# Altium project Compact Inverter DC Link V5.PrjPcb
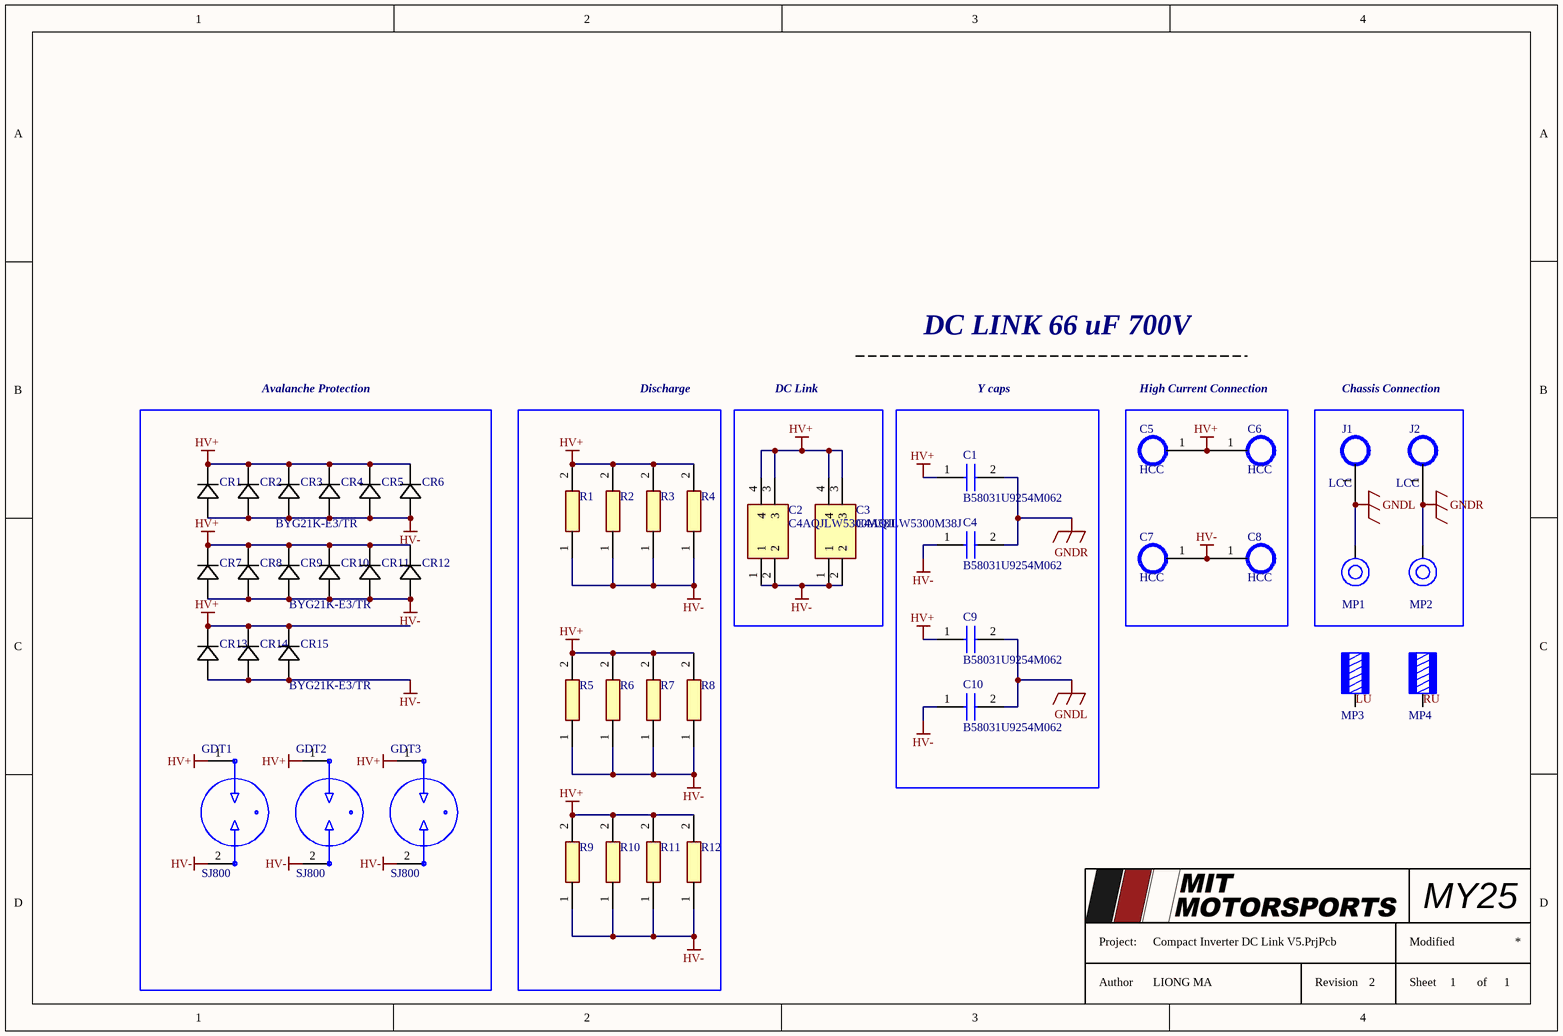
[diagram p0: Schematic.SchDoc]
Model: 24
1 sheet, 46 parts. Net scope: global (net labels, ports and power ports of the same name join across sheets).
Board file: PCB.PcbDoc

## Sheet Schematic.SchDoc
size A4; Author: LIONG MA; Revision: 2; SheetNumber: 1; SheetTotal: 1

### Parts
C1  B58031U9254M062  [B58031U9254M062]
C2  C4AQJLW5300M38J  [C4AQJLW5300M38J]
C3  C4AQJLW5300M38J  [C4AQJLW5300M38J]
C4  B58031U9254M062  [B58031U9254M062]
C5  HCC  [6mm Pad]
C6  HCC  [6mm Pad]
C7  HCC  [6mm Pad]
C8  HCC  [6mm Pad]
C9  B58031U9254M062  [B58031U9254M062]
C10  B58031U9254M062  [B58031U9254M062]
CR1  BYG21K-E3/TR  [DO-214AC_VIS]
CR2  BYG21K-E3/TR  [DO-214AC_VIS]  (value not drawn)
CR3  BYG21K-E3/TR  [DO-214AC_VIS]  (value not drawn)
CR4  BYG21K-E3/TR  [DO-214AC_VIS]  (value not drawn)
CR5  BYG21K-E3/TR  [DO-214AC_VIS]  (value not drawn)
CR6  BYG21K-E3/TR  [DO-214AC_VIS]  (value not drawn)
CR7  BYG21K-E3/TR  [DO-214AC_VIS]
CR8  BYG21K-E3/TR  [DO-214AC_VIS]  (value not drawn)
CR9  BYG21K-E3/TR  [DO-214AC_VIS]  (value not drawn)
CR10  BYG21K-E3/TR  [DO-214AC_VIS]  (value not drawn)
CR11  BYG21K-E3/TR  [DO-214AC_VIS]  (value not drawn)
CR12  BYG21K-E3/TR  [DO-214AC_VIS]  (value not drawn)
CR13  BYG21K-E3/TR  [DO-214AC_VIS]
CR14  BYG21K-E3/TR  [DO-214AC_VIS]  (value not drawn)
CR15  BYG21K-E3/TR  [DO-214AC_VIS]  (value not drawn)
GDT1  SJ800  [SJ1000]
GDT2  SJ800  [SJ1000]
GDT3  SJ800  [SJ1000]
J1  LCC  [PAD 3MM]
J2  LCC  [PAD 3MM]
MP1  M3 x 2.6mm  [9775026360]  (value not drawn)
MP2  M3 x 2.6mm  [9775026360]  (value not drawn)
MP3  M3  [7466313]  (value not drawn)
MP4  M3  [7466313]  (value not drawn)
R1  CHV2512-JW-105ELF  [RESC6432X75N]  (value not drawn)
R2  CHV2512-JW-105ELF  [RESC6432X75N]  (value not drawn)
R3  CHV2512-JW-105ELF  [RESC6432X75N]  (value not drawn)
R4  CHV2512-JW-105ELF  [RESC6432X75N]  (value not drawn)
R5  CHV2512-JW-105ELF  [RESC6432X75N]  (value not drawn)
R6  CHV2512-JW-105ELF  [RESC6432X75N]  (value not drawn)
R7  CHV2512-JW-105ELF  [RESC6432X75N]  (value not drawn)
R8  CHV2512-JW-105ELF  [RESC6432X75N]  (value not drawn)
R9  CHV2512-JW-105ELF  [RESC6432X75N]  (value not drawn)
R10  CHV2512-JW-105ELF  [RESC6432X75N]  (value not drawn)
R11  CHV2512-JW-105ELF  [RESC6432X75N]  (value not drawn)
R12  CHV2512-JW-105ELF  [RESC6432X75N]  (value not drawn)

### Blocks framed on the sheet
Avalanche Protection: CR1-CR15 GDT1-GDT3
Discharge: R1-R12
DC Link: C2 C3
Y caps: C1 C4 C9 C10
High Current Connection: C5-C8
Chassis Connection: J1 J2 MP1 MP2

### Nets
GNDL: C9.2 C10.2 J1.1 MP1.1
GNDR: C1.2 C4.2 J2.1 MP2.1
HV+: C1.1 C2.3 C2.4 C3.3 C3.4 C5.1 C6.1 C9.1 CR1.1 CR2.1 CR3.1 CR4.1 CR5.1 CR6.1 CR7.1 CR8.1 CR9.1 CR10.1 CR11.1 CR12.1 CR13.1 CR14.1 CR15.1 GDT1.1 GDT2.1 GDT3.1 R1.2 R2.2 R3.2 R4.2 R5.2 R6.2 R7.2 R8.2 R9.2 R10.2 R11.2 R12.2
HV-: C2.1 C2.2 C3.1 C3.2 C4.1 C7.1 C8.1 C10.1 CR1.2 CR2.2 CR3.2 CR4.2 CR5.2 CR6.2 CR7.2 CR8.2 CR9.2 CR10.2 CR11.2 CR12.2 CR13.2 CR14.2 CR15.2 GDT1.2 GDT2.2 GDT3.2 R1.1 R2.1 R3.1 R4.1 R5.1 R6.1 R7.1 R8.1 R9.1 R10.1 R11.1 R12.1
LU: MP3.1
RU: MP4.1

### Notes on the sheet
- DC LINK 66 uF 700V
- MY
- 25
- Project:
- Author
- Revision
- Sheet
- Modified
- of

### Library data of the parts
C1 C4 C9 C10 = B58031U9254M062: Capacitor; Manufacturer_Name: TDK; Datasheet Link: https://product.tdk.com/system/files/dam/doc/product/capacitor/ceramic/ceralink/data_sheet/20/10/ds/b58031_lp.pdf; Height: 4.5mm; Manufacturer_Part_Number: B58031U9254M062; Mouser Part Number: 871-B58031U9254M062; Mouser Price/Stock: https://www.mouser.co.uk/ProductDetail/EPCOS-TDK/B58031U9254M062?qs=Mv7BduZupUir5egwM6Ifng%3D%3D; Arrow Part Number: B58031U9254M062; Arrow Price/Stock: https://www.arrow.com/en/products/b58031u9254m062/tdk?region=europe
C2 C3 = C4AQJLW5300M38J: Capacitor; Manufacturer_Name: KEMET; Datasheet Link: https://content.kemet.com/datasheets/KEM_F3125_C4AQ_M.pdf; Height: 25.2mm; Manufacturer_Part_Number: C4AQJLW5300M38J; Mouser Part Number: 80-C4AQJLW5300M38J; Mouser Price/Stock: https://www.mouser.co.uk/ProductDetail/KEMET/C4AQJLW5300M38J?qs=81r%252BiQLm7BQPDIKgnvCGAA%3D%3D
CR1-CR15 = BYG21K-E3TR: 1.5A,800V,120nS FS AVALANCHE SMD; Manufacturer_Name: Vishay; Copyright: Copyright (C) 2025 Ultra Librarian. All rights reserved.; Manufacturer_Part_Number: BYG21K-E3/TR; Datasheet: https://www.vishay.com/doc?88961
GDT1-GDT3 = SJ800: Gas Discharge Tube; Manufacturer_Name: LITTELFUSE; Datasheet Link: https://www.littelfuse.com/assetdocs/gas-discharge-tubes-sj-datasheet?assetguid=53b7eae5-00a8-4e77-9ff5-6f0a5c35dc61; Height: 3.5mm; Manufacturer_Part_Number: SJ800
MP1 MP2 = 9775026360R: WA-SMSR SMT Steel Spacer Reverse, M3 x 2.6mm; Manufacturer: Wurth Elektronik; Inside Diameter: 4.2mm; Outside Diameter: 6mm; Surface: Tin; ComponentLink1Description: Website Link; ComponentLink1URL: https://www.we-online.com/redexpert/article/9775026360R?ad; ComponentLink2Description: Datasheet Link; ComponentLink2URL: https://www.we-online.com/redexpert/spec/9775026360R?ad; Manufacturer Part Number: 9775026360R; Category: SMT Spacers; Match Code: WA-SMSR; Mount: Surface Mount; Operating Temperature Max: 150°C; Operating Temperature Min: -55°C; Packaging: Tape and Reel; Material: Steel; Pin Length: 2.6mm; Thread Size: M3
MP3 MP4 = 7466313R: WP-SMRA REDCUBE SMT Right Angled with pins, M3, 50A; Manufacturer: Wurth Elektronik; Surface: Tin; ComponentLink1Description: Website Link; ComponentLink1URL: https://www.we-online.com/redexpert/article/7466313R?ad; ComponentLink2Description: Datasheet Link; ComponentLink2URL: https://www.we-online.com/redexpert/spec/7466313R?ad; Manufacturer Part Number: 7466313R; Category: REDCUBE SMT; Match Code: WP-SMRA; Mount: Surface Mount; Operating Temperature Max: 150°C; Operating Temperature Min: -55°C; Packaging: Tape and Reel; Height: 7mm; Material: Brass; Rated Current: 50A; Thread Size: M3
R1-R12 = CHV2512-JW-105ELF: Resistor; Manufacturer_Name: Bourns; Datasheet Link: https://componentsearchengine.com/Datasheets/1/CHV2512-JW-107ELF.pdf; Height: 0.75mm; Manufacturer_Part_Number: CHV2512-JW-105ELF; Mouser Part Number: 652-CHV2512JW105ELF; Mouser Price/Stock: https://www.mouser.co.uk/ProductDetail/Bourns/CHV2512-JW-105ELF?qs=Y39dXtdJQR3hOiRXwW8xyA%3D%3D; Arrow Part Number: CHV2512-JW-105ELF; Arrow Price/Stock: https://www.arrow.com/en/products/chv2512-jw-105elf/bourns